# EAGLE schematic Attiny13 (EAGLE 8.2.2)
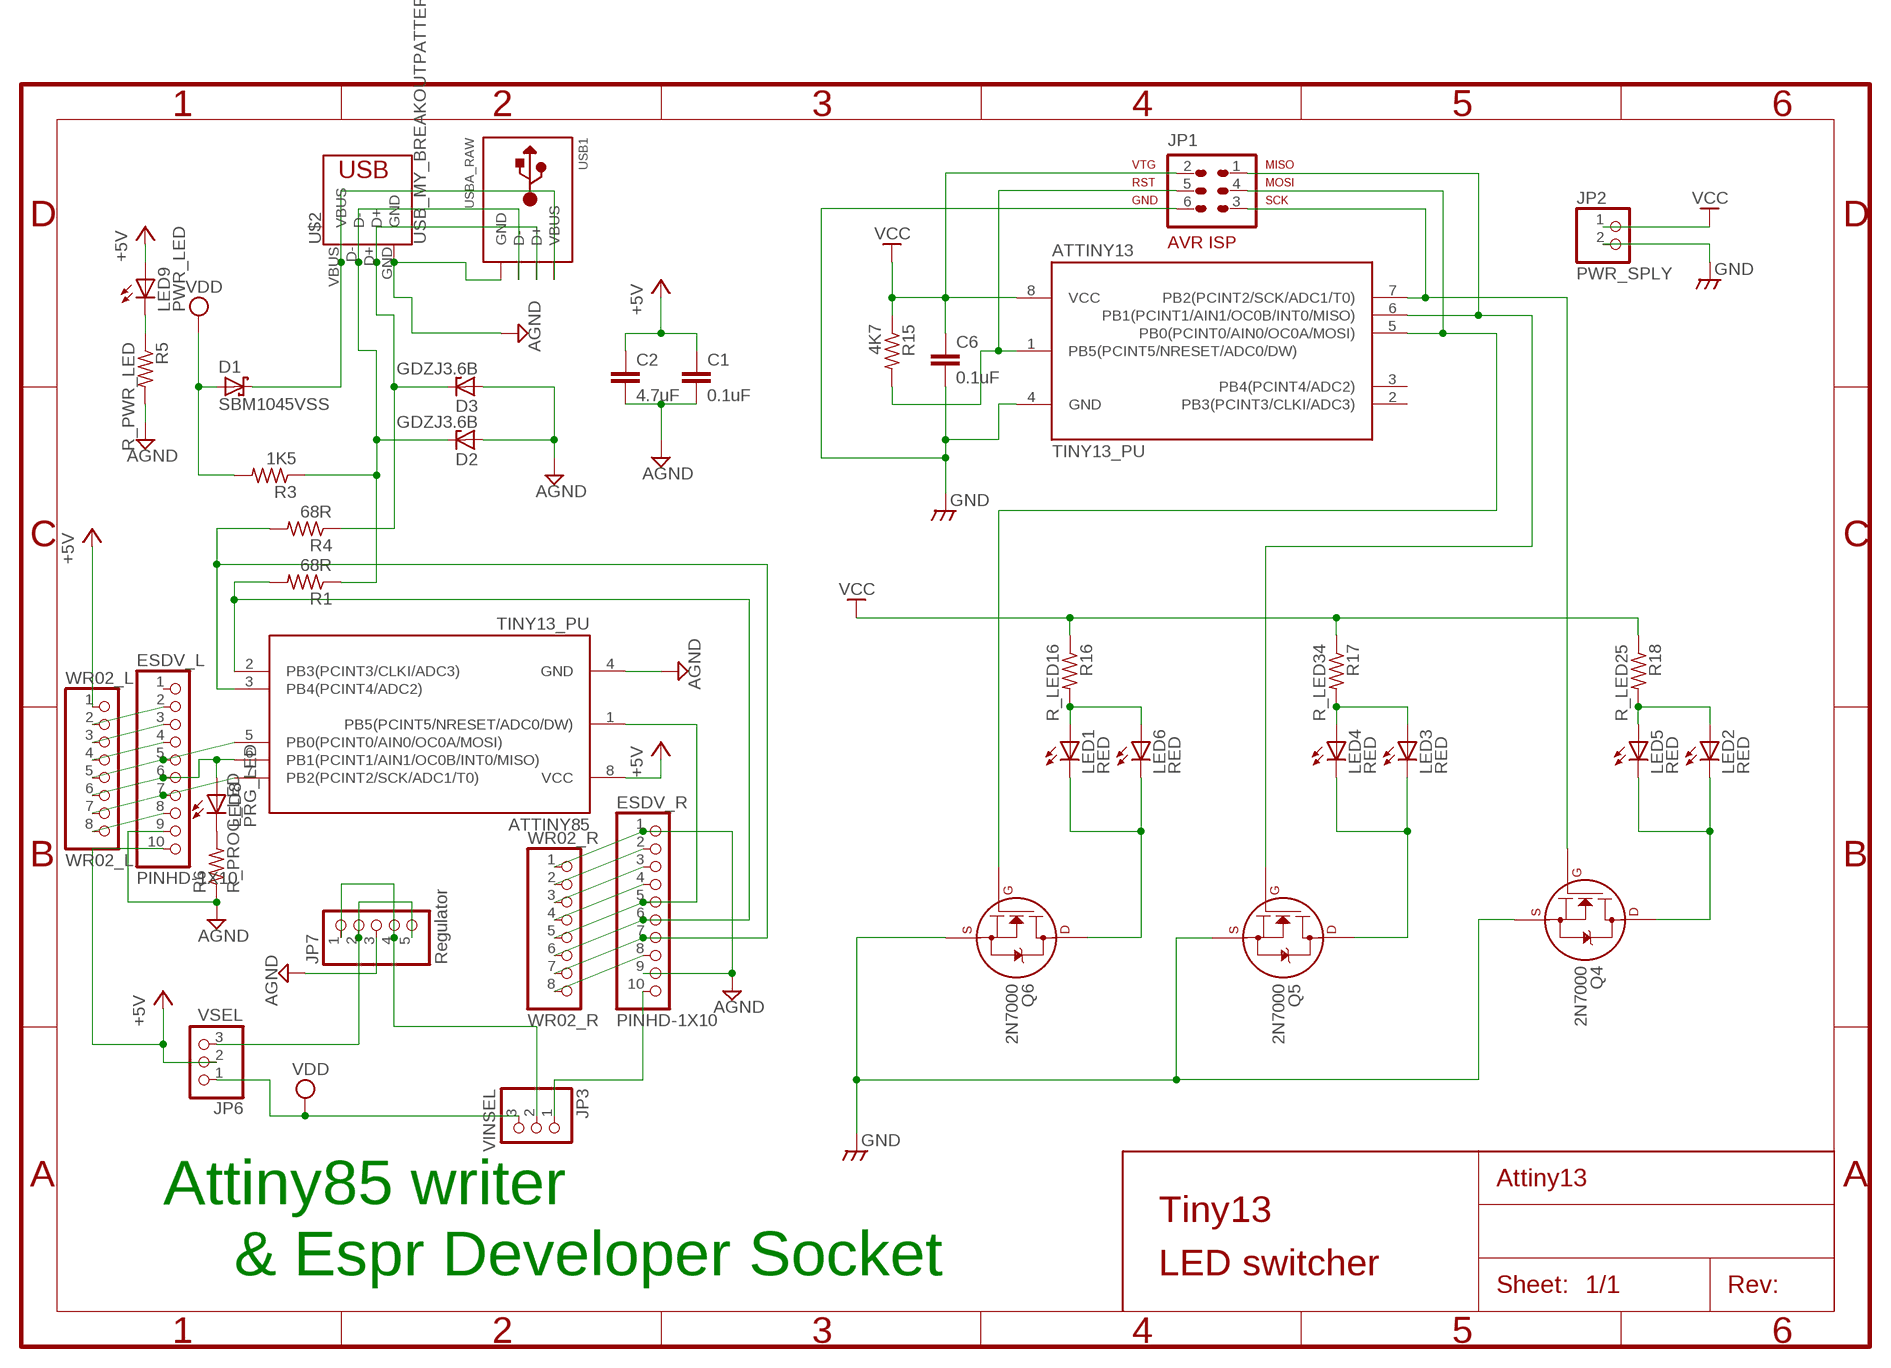
[diagram p0: schematic, sheet 1]

## Parts
ATTINY13  TINY13_PU  [TINY_DIL08]
ATTINY85  TINY13_PU  [TINY_DIL08]
C1  0.1uF  C-EU050-025X075  [C050-025X075]
C2  4.7uF  C-EU050-025X075  [C050-025X075]
C6  0.1uF  C-EU050-025X075  [C050-025X075]
D1  SBM1045VSS  SCHOTTKY-DIODEDO41  [DO41-10]
D2  GDZJ3.6B  ZENER-DIODEDO34-7  [DO34Z7]
D3  GDZJ3.6B  ZENER-DIODEDO34-7  [DO34Z7]
ESDV_L  PINHD-1X10  [1X10-BIG]
ESDV_R  PINHD-1X10  [1X10-BIG]
JP1  AVR-ISP-6  [AVR-ISP-6]
JP2  PWR_SPLY  PINHD-1X2  [1X02]
JP3  VINSEL  PINHD-1X3  [1X03]
JP6  VSEL  PINHD-1X3  [1X03]
JP7  Regulator  PINHD-1X5  [1X05]
LED1  RED  LEDSFH480  [SFH480]
LED2  RED  LEDSFH480  [SFH480]
LED3  RED  LEDSFH480  [SFH480]
LED4  RED  LEDSFH480  [SFH480]
LED5  RED  LEDSFH480  [SFH480]
LED6  RED  LEDSFH480  [SFH480]
LED8  PRG_LED  LEDSFH480  [SFH480]
LED9  PWR_LED  LEDSFH480  [SFH480]
Q4  2N7000  2N7000_TO92  [TO-92]
Q5  2N7000  2N7000_TO92  [TO-92]
Q6  2N7000  2N7000_TO92  [TO-92]
R1  68R  R-US_0204/7  [0204/7]
R3  1K5  R-US_0204/7  [0204/7]
R4  68R  R-US_0204/7  [0204/7]
R5  R_PWR_LED  R-US_0204/7  [0204/7]
R6  R_PROG_LED  R-US_0204/7  [0204/7]
R15  4K7  R-US_0204/7  [0204/7]
R16  R_LED16  R-US_0204/7  [0204/7]
R17  R_LED34  R-US_0204/7  [0204/7]
R18  R_LED25  R-US_0204/7  [0204/7]
U$2  USB_MY_BREAKOUTPATTERN2  [USB_MY_BREAKOUT2]
USB1  USBA_RAW  [USBA_RAW]
WR02_L  WR02_L  PINHD-1X8BIG  [1X08-BIG]
WR02_R  WR02_R  PINHD-1X8BIG  [1X08-BIG]

## Nets
+5V [Power]: ATTINY85.8(VCC) C1.1 C2.1 ESDV_L.10 JP6.2 LED9.A WR02_L.1
AGND [Power]: ATTINY85.4(GND) C1.2 C2.2 D2.A D3.A ESDV_L.9 ESDV_R.1 ESDV_R.9 JP7.3 R5.2 R6.1 U$2.GND USB1.GND WR02_R.1
GND [Power]: ATTINY13.4(GND) C6.2 JP1.6 JP2.2 Q4.1(S) Q5.1(S) Q6.1(S)
N$1 [Power]: D1.C U$2.VBUS USB1.VBUS
N$2: ATTINY13.7(PB2(PCINT2/SCK/ADC1/T0)) JP1.3 Q4.2(G)
N$3: ATTINY85.2(PB3(PCINT3/CLKI/ADC3)) ESDV_R.6 R1.2 WR02_R.6
N$4: D2.C R1.1 R3.1 U$2.D- USB1.D-
N$5: LED1.K(C) LED6.K(C) Q6.3(D)
N$6: ATTINY13.5(PB0(PCINT0/AIN0/OC0A/MOSI)) JP1.4 Q6.2(G)
N$7: ATTINY13.1(PB5(PCINT5/NRESET/ADC0/DW)) JP1.5 R15.2
N$8: ATTINY13.6(PB1(PCINT1/AIN1/OC0B/INT0/MISO)) JP1.1 Q5.2(G)
N$9: LED2.K(C) LED5.K(C) Q4.3(D)
N$10: LED3.K(C) LED4.K(C) Q5.3(D)
N$11: ATTINY85.3(PB4(PCINT4/ADC2)) ESDV_R.7 R4.2 WR02_R.7
N$12: ATTINY85.1(PB5(PCINT5/NRESET/ADC0/DW)) ESDV_R.5 WR02_R.5
N$13: LED9.K(C) R5.1
N$14: LED8.K(C) R6.2
N$15: ATTINY85.6(PB1(PCINT1/AIN1/OC0B/INT0/MISO)) ESDV_L.6 LED8.A WR02_L.6
N$16: ATTINY85.5(PB0(PCINT0/AIN0/OC0A/MOSI)) ESDV_L.5 WR02_L.5
N$17: JP3.2 JP7.1 JP7.4
N$18: ATTINY85.7(PB2(PCINT2/SCK/ADC1/T0)) ESDV_L.7 WR02_L.7
N$19: D3.C R4.1 U$2.D+ USB1.D+
N$20: ESDV_R.10 JP3.1
N$21: ESDV_L.2 WR02_L.2
N$22: ESDV_L.3 WR02_L.3
N$23: ESDV_L.4 WR02_L.4
N$24: ESDV_L.8 WR02_L.8
N$25: ESDV_R.2 WR02_R.2
N$26: JP6.3 JP7.2 JP7.5
N$27: ESDV_R.3 WR02_R.3
N$28: ESDV_R.4 WR02_R.4
N$29: ESDV_R.8 WR02_R.8
N$30: LED1.A LED6.A R16.2
N$31: LED3.A LED4.A R17.2
N$32: LED2.A LED5.A R18.2
VCC [Power]: ATTINY13.8(VCC) C6.1 JP1.2 JP2.1 R15.1 R16.1 R17.1 R18.1
VDD: D1.A JP3.3 JP6.1 R3.2
Unconnected: ATTINY13.2(PB3(PCINT3/CLKI/ADC3)) ATTINY13.3(PB4(PCINT4/ADC2)) ESDV_L.1

## Notes on the sheet
- Attiny85 writer
- Tiny13
- & Espr Developer Socket | LED switcher

## Library data of the parts
ATTINY13 ATTINY85 = MyParts:TINY13_PU: TINY13/85
C1 C2 C6 = resistor:C-EU: CAPACITOR, European symbol
D1 = adafruit:SCHOTTKY-DIODE: Schottky Diode
D2 D3 = diode:ZENER-DIODE: Z-Diode
ESDV_L ESDV_R = adafruit:PINHD-1X10: Pin header 1x10 0.1" spacing With round pins
JP1 = atmel:AVR-ISP-6: AVR ISP-6 Serial Programming Header
JP2 = pinhead:PINHD-1X2: PIN HEADER
JP3 JP6 = pinhead:PINHD-1X3: PIN HEADER
JP7 = pinhead:PINHD-1X5: PIN HEADER
LED1-LED6 = led:LED: LED
LED8 LED9 = adafruit:LED: LED
Q4-Q6 = transistors:2N700*: 2N7000, 2N7002, NDS7002A N-channel enhancement mode MOSFET
R1 R3-R6 R15-R18 = resistor:R-US_: RESISTOR, American symbol
U$2 = MyParts:USB_MY_BREAKOUT: >Original pin holes for USB breakout board
USB1 = MyParts:USBA_RAW: USB TYPEA RAW CONNECTOR
WR02_L WR02_R = adafruit:PINHD-1X8: PIN HEADER

## Net classes
0 default: width 0.61 mm, clearance 0.508 mm
1 Power: width 0.762 mm, clearance 0.762 mm